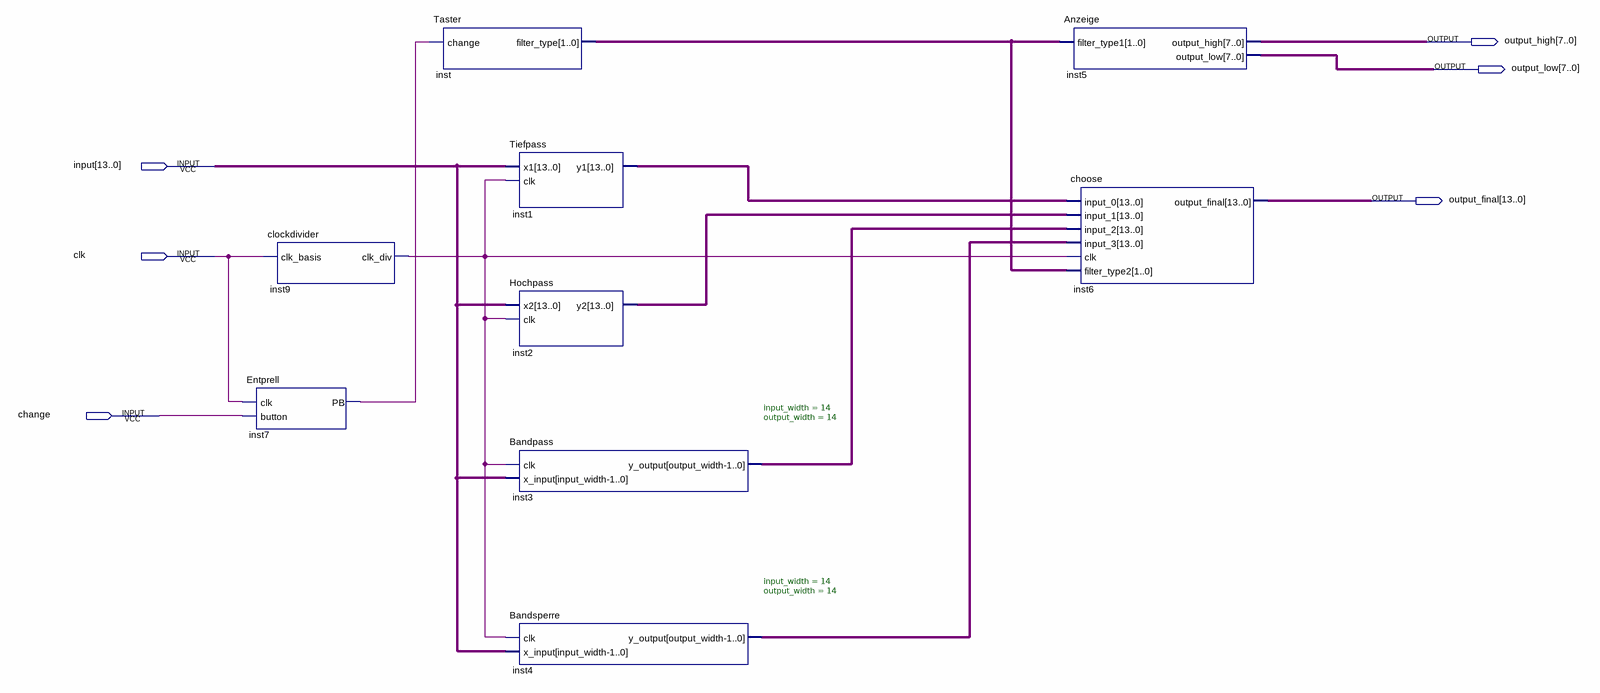
[diagram p0: schematic sheet]
// Quartus schematic Filter_gesamt.bdf as structural Verilog: 9 symbols, 6 pins
module Filter_gesamt (
  input  [13:0] \input ,
  input  clk,
  input  change,
  output [7:0] output_high,
  output [7:0] output_low,
  output [13:0] output_final
);

  wire inst7_pb, inst9_clk_div;
  wire [1:0] inst_filter_type;
  wire [13:0] inst1_y1, inst2_y2, inst3_y_output, inst4_y_output;

  Entprell inst7 (.clk(clk), .button(change), .PB(inst7_pb));
  clockdivider inst9 (.clk_basis(clk), .clk_div(inst9_clk_div));
  Taster inst (.change(inst7_pb), .filter_type(inst_filter_type));
  Tiefpass inst1 (.x1(\input ), .clk(inst9_clk_div), .y1(inst1_y1));
  Hochpass inst2 (.x2(\input ), .clk(inst9_clk_div), .y2(inst2_y2));
  Bandpass #(.input_width(14), .output_width(14)) inst3 (
    .clk(inst9_clk_div), .x_input(\input ), .y_output(inst3_y_output));
  Bandsperre #(.input_width(14), .output_width(14)) inst4 (
    .clk(inst9_clk_div), .x_input(\input ), .y_output(inst4_y_output));
  Anzeige inst5 (.filter_type1(inst_filter_type), .output_high(output_high), .output_low(output_low));
  choose inst6 (
    .input_0(inst1_y1), .input_1(inst2_y2), .input_2(inst3_y_output), .input_3(inst4_y_output),
    .clk(inst9_clk_div), .filter_type2(inst_filter_type), .output_final(output_final));
endmodule
